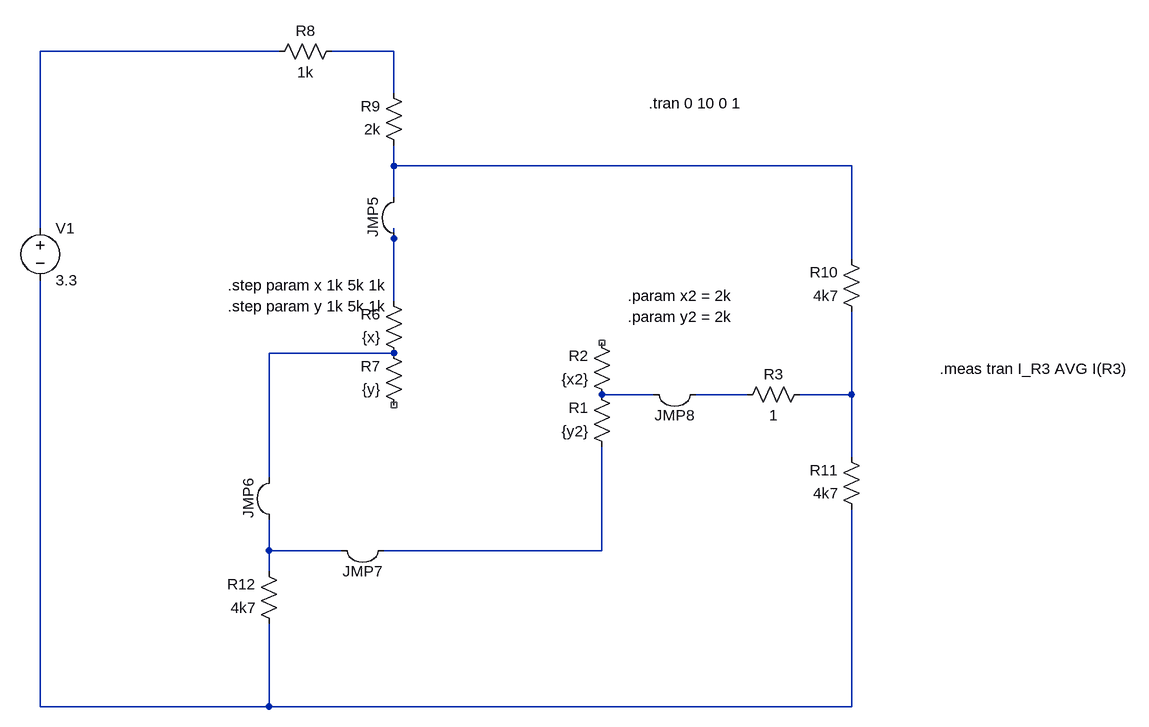
[diagram p0: schematic Draft1.asc]
Draft1.asc, the LTspice schematic file:
Version 4.1
SHEET 1 1460 1080
WIRE 16 64 -352 64
WIRE 192 64 96 64
WIRE 192 128 192 64
WIRE 192 240 192 208
WIRE 896 240 192 240
WIRE 192 288 192 240
WIRE -352 336 -352 64
WIRE 192 352 192 336
WIRE 896 384 896 240
WIRE 192 448 192 352
WIRE 192 528 0 528
WIRE 592 592 512 592
WIRE 736 592 656 592
WIRE 896 592 896 464
WIRE 896 592 816 592
WIRE 896 688 896 592
WIRE 0 720 0 528
WIRE 0 832 0 784
WIRE 112 832 0 832
WIRE 512 832 512 672
WIRE 512 832 176 832
WIRE 0 864 0 832
WIRE -352 1072 -352 416
WIRE 0 1072 0 944
WIRE 0 1072 -352 1072
WIRE 896 1072 896 768
WIRE 896 1072 0 1072
SYMBOL res 112 48 R90
WINDOW 0 0 56 VBottom 2
WINDOW 3 32 56 VTop 2
SYMATTR InstName R8
SYMATTR Value 1k
SYMBOL res 208 224 R180
WINDOW 0 36 76 Left 2
WINDOW 3 36 40 Left 2
SYMATTR InstName R9
SYMATTR Value 2k
SYMBOL res 912 480 R180
WINDOW 0 36 76 Left 2
WINDOW 3 36 40 Left 2
SYMATTR InstName R10
SYMATTR Value 4k7
SYMBOL res 912 784 R180
WINDOW 0 36 76 Left 2
WINDOW 3 36 40 Left 2
SYMATTR InstName R11
SYMATTR Value 4k7
SYMBOL res 16 960 R180
WINDOW 0 36 76 Left 2
WINDOW 3 36 40 Left 2
SYMATTR InstName R12
SYMATTR Value 4k7
SYMBOL res 208 544 R180
WINDOW 0 36 76 Left 2
WINDOW 3 36 40 Left 2
SYMATTR InstName R6
SYMATTR Value {x}
SYMBOL res 208 624 R180
WINDOW 0 36 76 Left 2
WINDOW 3 36 40 Left 2
SYMATTR InstName R7
SYMATTR Value {y}
SYMBOL res 528 688 R180
WINDOW 0 36 76 Left 2
WINDOW 3 36 40 Left 2
SYMATTR InstName R1
SYMATTR Value {y2}
SYMBOL res 528 608 R180
WINDOW 0 36 76 Left 2
WINDOW 3 36 40 Left 2
SYMATTR InstName R2
SYMATTR Value {x2}
SYMBOL voltage -352 320 R0
WINDOW 123 0 0 Left 0
WINDOW 39 0 0 Left 0
SYMATTR InstName V1
SYMATTR Value 3.3
SYMBOL Misc\\jumper 128 320 R270
SYMATTR InstName JMP5
SYMBOL Misc\\jumper -64 752 R270
SYMATTR InstName JMP6
SYMBOL Misc\\jumper 144 896 R180
SYMATTR InstName JMP7
SYMBOL Misc\\jumper 624 656 R180
SYMATTR InstName JMP8
SYMBOL res 832 576 R90
WINDOW 0 0 56 VBottom 2
WINDOW 3 32 56 VTop 2
SYMATTR InstName R3
SYMATTR Value 1
TEXT -64 424 Left 2 !.step param x 1k 5k 1k
TEXT -64 456 Left 2 !.step param y 1k 5k 1k
TEXT 552 440 Left 2 !.param x2 = 2k
TEXT 552 472 Left 2 !.param y2 = 2k
TEXT 584 144 Left 2 !.tran 0 10 0 1
TEXT 1032 552 Left 2 !.meas tran I_R3 AVG I(R3)

The netlist it stands for:
* Draft1.asc
R8 N002 N001 1k
R9 N003 N002 2k
R10 N006 N003 4k7
R11 N007 N006 4k7
R12 N007 N004 4k7
R6 N004 N003 {x}
R7 NC_01 N004 {y}
R1 N004 N005 {y2}
R2 N005 NC_02 {x2}
V1 N001 N007 3.3
R3 N006 N005 1
.step param x 1k 5k 1k
.step param y 1k 5k 1k
.param x2 = 2k
.param y2 = 2k
.tran 0 10 0 1
.meas tran I_R3 AVG I(R3)
.backanno
.end